# Altium schematic sheet ESP8266.SchDoc
size A4
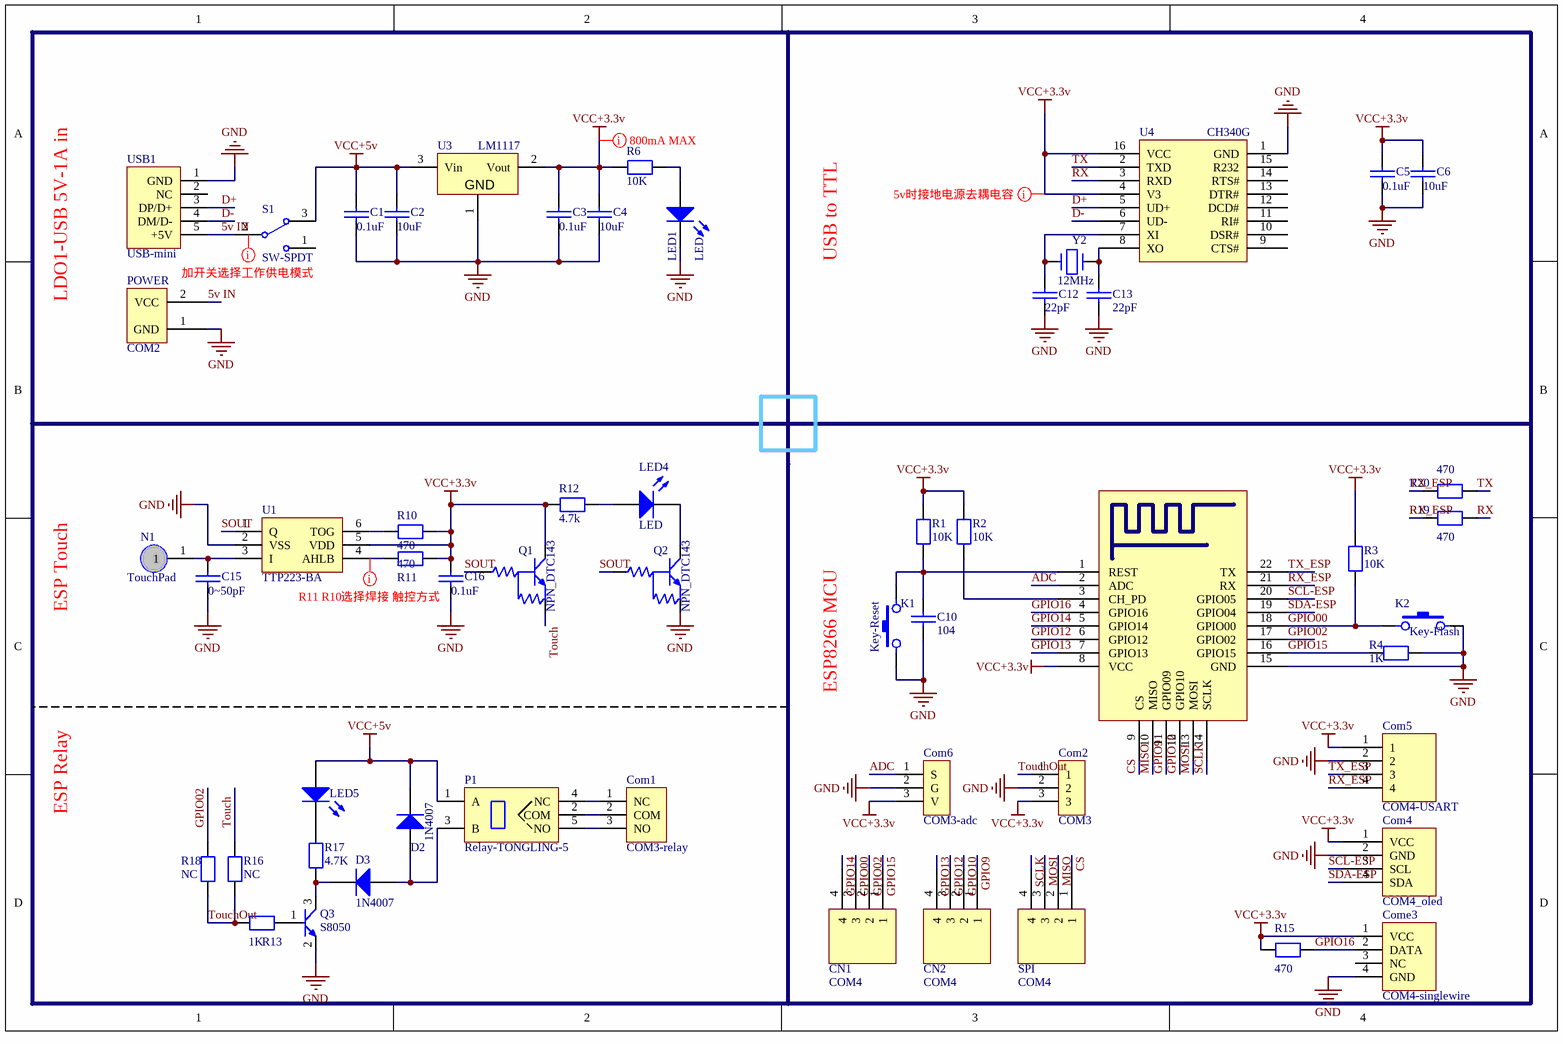
[diagram p0: ESP8266.SchDoc]

## Parts
C1  0.1uF  [0603C]
C2  10uF  [0603C]
C3  0.1uF  [0603C]
C4  10uF  [0603C]
C5  0.1uF  [0603C]
C6  10uF  [0603C]
C10  104  [0603C]
C12  22pF  [0603C]
C13  22pF  [0603C]
C15  0~50pF  [0603C]
C16  0.1uF  [0603C]
CN1  COM4  [HDR2.54-LI-4P]
CN2  COM4  [HDR2.54-LI-4P]
Com1  COM3-relay  [KF301-5.0-3P]
Com2  COM3  [HDR2.54-M-LI-3P]
Com4  COM4_oled  [HDR2.54-4P]
Com5  COM4-USART  [HDR2.54-LI-4P]
Com6  COM3-adc  [HDR2.54-LI-3P]
Come3  COM4-singlewire  [HDR2.54-4P]
D2  1N4007  [SOD-123]
D3  1N4007  [SOD-123]
K1  Key-Reset  [TSW SMD-3*6*2.5]
K2  Key-Flash  [TSW SMD-3*6*2.5]
LED1  LED  [0603D]
LED4  LED  [0603D]
LED5  LED 0603  [0603D]  (value not drawn)
N1  TouchPad  [TouchPad]
P1  Relay-TONGLING-5  [TONGLING-relay-5]
POWER  COM2  [COM2]
Q1  NPN_DTC143  [SOT-523]
Q2  NPN_DTC143  [SOT-523]
Q3  S8050  [SOT23]
R1  10K  [0603R]
R2  10K  [0603R]
R3  10K  [0603R]
R4  1K  [0603R]
R6  10K  [0603R]
R10  470  [0603R]
R11  470  [0603R]
R12  4.7k  [0603R]
R13  1K  [0603R]
R15  470  [0603R]
R16  NC  [0603R]
R17  4.7K  [0603R]
R18  NC  [0603R]
R19  470  [0603R]
R20  470  [0603R]
S1  SW-SPDT  [MSK-12C01-07]
SPI  COM4  [HDR2.54-LI-4P]
U1  TTP223-BA  [SOT23-6]
U2  ESP8266  (value not drawn)
U3  LM1117  [SOT223]
U4  CH340G  [SOP16]
USB1  USB-mini  [USB-micro_A]
Y2  12MHz  [YYC 6035-2P]

## Nets
GND: C1.2 C2.2 C3.2 C4.2 C5.2 C6.2 C10.2 C12.2 C13.2 C15.2 C16.2 Com2.2 Com4.2(GND) Com5.2 Com6.2(G) Come3.4(GND) K1.1 K2.2 LED1.2(K) POWER.1(GND) Q2.2 Q3.2 R4.1 U1.2(VSS) U2.15(GND) U3.1(ADJ) U4.1(GND) USB1.1(GND)
VCC+3.3v: C3.1 C4.1 C5.1 C6.1 C16.1 Com2.3 Com4.1(VCC) Com5.1 Com6.3(V) Come3.1(VCC) Q1.3 R1.2 R2.2 R3.2 R6.2 R10.1 R11.1 R12.1 R15.2 U1.5(VDD) U2.8(VCC) U3.2(Vout) U4.4(V3) U4.16(VCC)
VCC+5v: C1.1 C2.1 D2.2(K) LED5.1(A) P1.1(A) S1.3 U3.3(Vin)
5v IN: POWER.2(VCC) S1.2 USB1.5(+5V)
ADC: Com6.1(S) U2.2(ADC)
CS: SPI.1 U2.9(CS)
D+: U4.5(UD+) USB1.3(DP/D+)
D-: U4.6(UD-) USB1.4(DM/D-)
GPIO00: CN1.3 K2.1 R3.1 U2.18(GPIO00)
GPIO02: CN1.2 R18.1 U2.17(GPIO02)
GPIO9: CN2.1 U2.11(GPIO09)
GPIO10: CN2.2 U2.12(GPIO10)
GPIO12: CN2.3 U2.6(GPIO12)
GPIO13: CN2.4 U2.7(GPIO13)
GPIO14: CN1.4 U2.5(GPIO14)
GPIO15: CN1.1 R4.2 U2.16(GPIO15)
GPIO16: Come3.2(DATA) R15.1 U2.4(GPIO16)
MISO: SPI.2 U2.10(MISO)
MOSI: SPI.3 U2.13(MOSI)
RX: R19.1 U4.3(RXD)
RX_ESP: Com5.4 R19.2 U2.21(RX)
SCL-ESP: Com4.3(SCL) U2.20(GPIO05)
SCLK: SPI.4 U2.14(SCLK)
SDA-ESP: Com4.4(SDA) U2.19(GPIO04)
SOUT: Q1.1 Q2.1 U1.1(Q)
Touch: Q1.2 R16.1
TouchOut: Com2.1 R13.2 R16.2 R18.2
TX: R20.1 U4.2(TXD)
TX_ESP: Com5.3 R20.2 U2.22(TX)
NetC10_1: C10.1 K1.2 R1.1 U2.1(REST)
NetC12_1: C12.1 U4.7(XI) Y2.1
NetC13_1: C13.1 U4.8(XO) Y2.2
NetC15_1: C15.1 N1.1 U1.3(I)
NetCom1_1: Com1.1(NC) P1.4(NC)
NetCom1_2: Com1.2(COM) P1.2(COM)
NetCom1_3: Com1.3(NO) P1.5(NO)
NetD2_1: D2.1(A) D3.1(A) P1.3(B)
NetD3_2: D3.2(K) Q3.3 R17.2
NetLED1_1: LED1.1(A) R6.1
NetLED4_1: LED4.1(A) R12.2
NetLED4_2: LED4.2(K) Q2.3
NetLED5_2: LED5.2(K) R17.1
NetQ3_1: Q3.1 R13.1
NetR2_1: R2.1 U2.3(CH_PD)
NetR10_2: R10.2 U1.6(TOG)
NetR11_2: R11.2 U1.4(AHLB)

Not connected (* = marked no-connect by the designer): Come3 3(NC); S1 1; U4 9(CTS#) 10(DSR#) 11(RI#) 12(DCD#) 13(DTR#) 14(RTS#) 15(R232); USB1 2(NC)

## Layout directives
mark named 800mA MAX: VCC+3.3v
mark named R11 R10选择焊接 触控方式: NetR11_2
mark named 加开关选择工作供电模式: (no net found under the mark)
mark named 5v时接地电源去耦电容: VCC+3.3v

## Notes on the sheet
- LDO1-USB 5V-1A in
- USB to TTL
- ESP Touch
- ESP8266 MCU
- ESP Relay
- (in symbol LM317) GND

## Library data of the parts
C1-C6 C10 C12 C13 C15 C16 = CAP: Capacitor
Com1 = COM3-relay: pin to pad: 1>3 3>1
Com5 = COM4
D2 D3 = Diode 1N914: High Conductance Fast Diode; Published: 8-Jun-2000; LatestRevisionDate: 17-Jul-2002; LatestRevisionNote: Re-released for DXP Platform.; DatasheetVersion: 1997; PackageReference: DO-35; Publisher: Altium Limited; PackageDescription: Diode, Axial; Body 3.8 x 1.9 mm (LxDia. max), Lead Dia. 0.53 mm (max); Code_JEDEC: DO-204-AH; ComponentLink1Description: Manufacturer Link; ComponentLink1URL: http://www.fairchildsemi.com/; ComponentLink2Description: Datasheet; ComponentLink2URL: http://www.fairchildsemi.com/ds/1N%2F1N4448.pdf
K1 K2 = Key
LED1 LED4 LED5 = LED2: Typical RED, GREEN, YELLOW, AMBER GaAs LED; Published: 8-Jun-2000; LatestRevisionDate: 17-Jul-2002; LatestRevisionNote: Re-released for DXP Platform.; PackageVersion: Feb-2002; PackageReference: 3.2X1.6X1.1; Publisher: Altium Limited; PackageDescription: SM LED; 2 Flat Leads
Q3 = NPN: NPN Transistor
R1-R4 R6 R10-R13 R15-R20 = RES1
S1 = SW-SPDT: SPDT Subminiature Toggle Switch, Right Angle Mounting, Vertical Actuation; pin to pad: 1>3 3>1; Published: 24-Mar-1999; LatestRevisionDate: 17-Dec-2003; LatestRevisionNote: Schematic revised, PCB Footprint replaced.; DatasheetVersion: 05-Dec-2000; PackageReference: TL36WW15050; Publisher: Altium Limited; PackageDescription: Switch; 4 Leads; ComponentLink1Description: Manufacturer Link; ComponentLink1URL: http://www.apem.com
U3 = LM317: pin to pad: 1>2 2>3 3>1
USB1 = USBmini: pin to pad: 1>5 2>4 4>2 5>1
Y2 = CrystalPassive